# Altium schematic sheet Sensor_Board.SchDoc
size A4; SheetNumber: 1; SheetTotal: 1
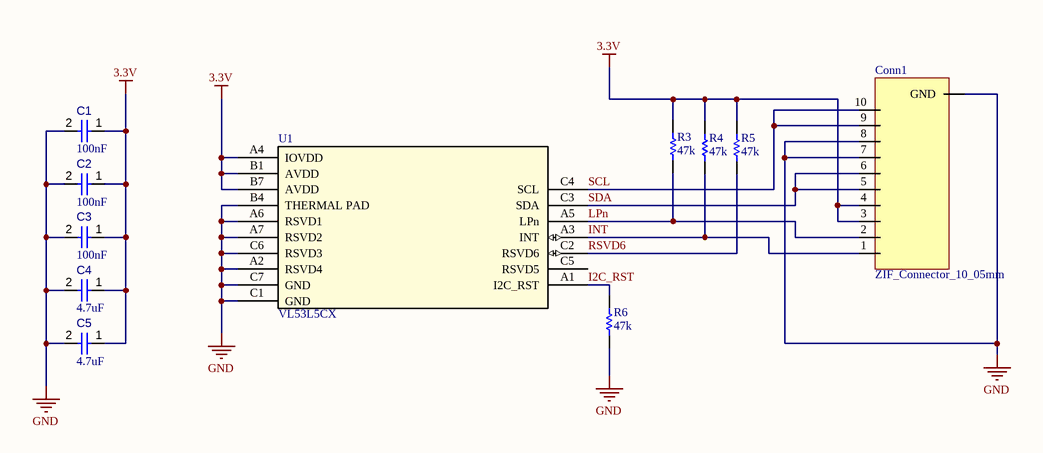
[diagram p0: Sensor_Board.SchDoc]

## Parts
C1  value 100nF  [CAPC1608X90X40NL10T20]  (hidden comment: Capacitor 100 nF +/-10% 50 V 0603)
C2  value 100nF  [CAPC1608X90X40NL10T20]  (hidden comment: Capacitor 100 nF +/-10% 50 V 0603)
C3  value 100nF  [CAPC1608X90X40NL10T20]  (hidden comment: Capacitor 100 nF +/-10% 50 V 0603)
C4  value 4.7uF  [CAPC1608X90X40NL10T20]  (hidden comment: Capacitor 100 nF +/-10% 50 V 0603)
C5  value 4.7uF  [CAPC1608X90X40NL10T20]  (hidden comment: Capacitor 100 nF +/-10% 50 V 0603)
Conn1  ZIF_Connector_10_05mm  [ZIF_Connector_10_05mm]
R3  value 47k  [RESC1608X55X25NL10T15]  (hidden comment: Resistor 0R +/- 5% 0603 100 mW)
R4  value 47k  [RESC1608X55X25NL10T15]  (hidden comment: Resistor 0R +/- 5% 0603 100 mW)
R5  value 47k  [RESC1608X55X25NL10T15]  (hidden comment: Resistor 0R +/- 5% 0603 100 mW)
R6  value 47k  [RESC1608X55X25NL10T15]  (hidden comment: Resistor 0R +/- 5% 0603 100 mW)
U1  VL53L5CX  [vl53l5cx]

## Nets
3.3V: C1.1 C2.1 C3.1 C4.1 C5.1 Conn1.3 Conn1.4 R3.1 R4.1 R5.1 U1.A4(IOVDD) U1.B1(AVDD) U1.B7(AVDD)
GND: C1.2 C2.2 C3.2 C4.2 C5.2 Conn1.7 Conn1.8 Conn1.GND R6.2 U1.A2(RSVD4) U1.A6(RSVD1) U1.A7(RSVD2) U1.B4(THERMAL_PAD) U1.C1(GND) U1.C6(RSVD3) U1.C7(GND)
I2C_RST: R6.1 U1.A1(I2C_RST)
INT: Conn1.1 R4.2 U1.A3(INT)
LPn: Conn1.2 R3.2 U1.A5(LPn)
RSVD6: R5.2 U1.C2(RSVD6)
SCL: Conn1.9 Conn1.10 U1.C4(SCL)
SDA: Conn1.5 Conn1.6 U1.C3(SDA)

Not connected (* = marked no-connect by the designer): U1 C5(RSVD5)

## Library data of the parts
C1-C5 = CMP-001-00017-5: Chip Capacitor, 100 nF, +/- 10%, 50 V, 0603 (1608 Metric); Voltage Rating: 50V; Capacitor Type: Ceramic; Mounting Technology: SM; Case/Package: 0603; Tolerance: 10%; Max Operating Temperature: 125°C; Min Operating Temperature: -55°C; Pins: 2; RoHS Compliant: True
R3-R6 = CMP-009-00006-4: Chip Resistor, 0 Ohm, 0.1 W, -55 to 155 degC, 0603 (1608 Metric); Power: 100mW; Voltage Rating: 50V; Pins: 2; Mounting Technology: SM; Case/Package: 0603; Max Operating Temperature: 155°C; RoHS Compliant: True; Min Operating Temperature: -55°C; Tolerance: 5%
U1 = VL53L5CX: No Description Available; Mfr_Name: STMicroelectronics; Manufacturer_Part_Number: VL53L5CXV0GC/1; Copyright: Copyright (C) 2022 Ultra Librarian. All rights reserved.; RefDes: RefDes; Type: DEV